# Altium schematic sheet Fet Module.SchDoc
size A4
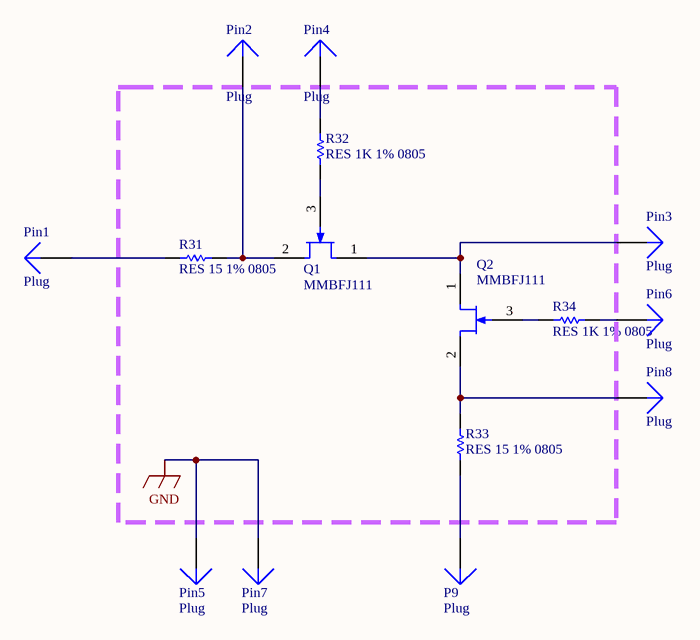
[diagram p0: Fet Module.SchDoc]

## Parts
P9  Plug  [PIN1]
Pin1  Plug  [PIN1]
Pin2  Plug  [PIN1]
Pin3  Plug  [PIN1]
Pin4  Plug  [PIN1]
Pin5  Plug  [PIN1]
Pin6  Plug  [PIN1]
Pin7  Plug  [PIN1]
Pin8  Plug  [PIN1]
Q1  MMBFJ111  [ONSC-SOT-23-3-318-08_V]
Q2  MMBFJ111  [ONSC-SOT-23-3-318-08_V]
R31  RES 15 1% 0805  [RESC2013X70X40LL20T20]
R32  RES 1K 1% 0805  [RESC2013X70X40LL20T20]
R33  RES 15 1% 0805  [RESC2013X70X40LL20T20]
R34  RES 1K 1% 0805  [RESC2013X70X40LL20T20]

## Nets
GND: Pin5.1 Pin7.1
NetP9_1: P9.1 R33.2
NetPin1_1: Pin1.1 R31.2
NetPin2_1: Pin2.1 Q1.2(S) R31.1
NetPin3_1: Pin3.1 Q1.1(D) Q2.1(D)
NetPin4_1: Pin4.1 R32.1
NetPin6_1: Pin6.1 R34.2
NetPin8_1: Pin8.1 Q2.2(S) R33.1
NetQ1_3: Q1.3(G) R32.2
NetQ2_3: Q2.3(G) R34.1

## Library data of the parts
Q1 Q2 = CMP-1062-00038-1: JFET - VHF / UJFET Chopper; PartNumber: MMBFJ310LT3; Manufacturer: On Semiconductor; IDSS Min (uA): 24000; Crss Max (pF): 2.5; Ciss Max (pF): 5; Channel Polarity: N Channel; V(BR)GSS Min (V): 25; Packing: Tape and Reel; IDSS Max (uA): 60000; ComponentLink1URL: http://www.onsemi.com/; PackageReference: SOT-23-3-318-08; ComponentLink3URL: http://www.onsemi.cn/pub_link/Collateral/318-08.PDF; PackageDescription: 3-Pin Small Outline Transistor, Body 2.92 x 1.3 mm, Pitch 0.95 mm; DatasheetVersion: Rev. 7; ComponentLink2URL: http://www.onsemi.cn/pub_link/Collateral/MMBFJ309LT1-D.PDF; ComponentLink2Description: Datasheet; PackageVersion: Rev. AP, 11/2009; ComponentLink1Description: Manufacturer URL; ComponentLink3Description: Package Specification; Mounting Technology: Surface Mount
R31 R33 = CMP-2001-00110-5: Resistor 15 1% 0805  0.2W 10ppm/C; Manufacturer: Panasonic; Voltage Rating: 150 V; Package Quantity: 5000; PackageDescription: 2-Pin Surface Mount Device, Body 2 x 1.25 mm; Mounting Technology: Surface Mount; ComponentLink2URL: http://industrial.panasonic.com/cdbs/www-data/pdf/RDA0000/AOA0000C86.pdf; DatasheetVersion: 04/2015; ComponentLink1URL: http://www.panasonic.com/; Mount: Surface Mount; ComponentLink1Description: Manufacturer URL; RoHSCompliant: true; PackageReference: 0805; Min Operating Temperature: -55 degC; Height: 0.6 mm; ComponentLink2Description: Datasheet; Max Operating Temperature: 155 degC; Length: 2 mm; Packaging: Tape and Reel; REACH SVHC: Yes
R32 = CMP-2001-00110-5: Resistor 1K 1% 0805  0.2W 10ppm/C; Manufacturer: Panasonic; Voltage Rating: 150 V; Package Quantity: 5000; PackageDescription: 2-Pin Surface Mount Device, Body 2 x 1.25 mm; Mounting Technology: Surface Mount; ComponentLink2URL: http://industrial.panasonic.com/cdbs/www-data/pdf/RDA0000/AOA0000C86.pdf; DatasheetVersion: 04/2015; ComponentLink1URL: http://www.panasonic.com/; Mount: Surface Mount; ComponentLink1Description: Manufacturer URL; RoHSCompliant: true; PackageReference: 0805; Min Operating Temperature: -55 degC; Height: 0.6 mm; ComponentLink2Description: Datasheet; Max Operating Temperature: 155 degC; Length: 2 mm; Packaging: Tape and Reel; REACH SVHC: Yes
R34 = CMP-2001-00110-5: Resistor 1K1% 0805  0.2W 10ppm/C; Manufacturer: Panasonic; Voltage Rating: 150 V; Package Quantity: 5000; PackageDescription: 2-Pin Surface Mount Device, Body 2 x 1.25 mm; Mounting Technology: Surface Mount; ComponentLink2URL: http://industrial.panasonic.com/cdbs/www-data/pdf/RDA0000/AOA0000C86.pdf; DatasheetVersion: 04/2015; ComponentLink1URL: http://www.panasonic.com/; Mount: Surface Mount; ComponentLink1Description: Manufacturer URL; RoHSCompliant: true; PackageReference: 0805; Min Operating Temperature: -55 degC; Height: 0.6 mm; ComponentLink2Description: Datasheet; Max Operating Temperature: 155 degC; Length: 2 mm; Packaging: Tape and Reel; REACH SVHC: Yes
P9 Pin1-Pin8 = Plug: LatestRevisionDate: 17-Jul-2002; LatestRevisionNote: Re-released for DXP Platform.; Publisher: Altium Limited